# EAGLE schematic massmfg_programming_jig (EAGLE 5.11)
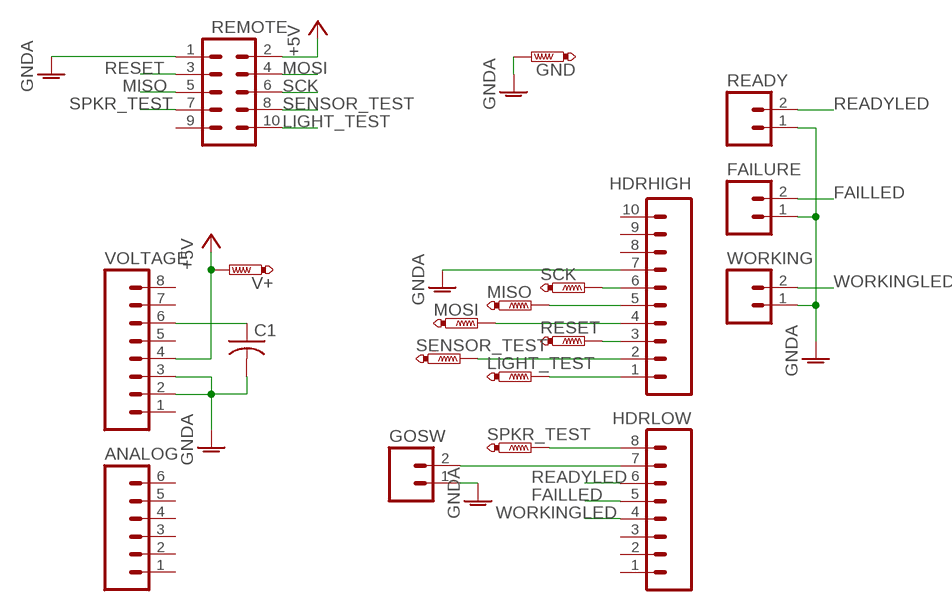
[diagram p0: schematic, sheet 1]

## Parts
ANALOG  M06LONGPADS  [1X06_LONGPADS]
C1  C-US025-024X044  [C025-024X044]
FAILURE  M02-JST-2-PTH-NO_SILK  [JST-2-PTH-NS]
GND  PTR1PAD1-20Y  [P1-20Y]
GOSW  M02-JST-2-PTH-NO_SILK  [JST-2-PTH-NS]
HDRHIGH  M10"  [1X10]
HDRLOW  M08LONGPADS  [1X08_LONGPADS]
LIGHT_TEST  PTR1PAD1-20Y  [P1-20Y]
MISO  PTR1PAD1-20Y  [P1-20Y]
MOSI  PTR1PAD1-20Y  [P1-20Y]
READY  M02-JST-2-PTH-NO_SILK  [JST-2-PTH-NS]
REMOTE  M05X2SHD  [2X5-SHROUDED]
RESET  PTR1PAD1-20Y  [P1-20Y]
SCK  PTR1PAD1-20Y  [P1-20Y]
SENSOR_TEST  PTR1PAD1-20Y  [P1-20Y]
SPKR_TEST  PTR1PAD1-20Y  [P1-20Y]
V+  PTR1PAD1-20Y  [P1-20Y]
VOLTAGE  M08LONGPADS  [1X08_LONGPADS]
WORKING  M02-JST-2-PTH-NO_SILK  [JST-2-PTH-NS]

## Nets
+5V: REMOTE.2 V+.TP VOLTAGE.4
FAILLED: FAILURE.2 HDRLOW.5
GNDA: C1.2 FAILURE.1 GND.TP GOSW.1 HDRHIGH.7 READY.1 REMOTE.1 VOLTAGE.2 VOLTAGE.3 WORKING.1
LIGHT_TEST: HDRHIGH.1 LIGHT_TEST.TP REMOTE.10
MISO: HDRHIGH.5 MISO.TP REMOTE.5
MOSI: HDRHIGH.4 MOSI.TP REMOTE.4
N$3: C1.1 VOLTAGE.6
N$5: GOSW.2 HDRLOW.7
READYLED: HDRLOW.6 READY.2
RESET: HDRHIGH.3 REMOTE.3 RESET.TP
SCK: HDRHIGH.6 REMOTE.6 SCK.TP
SENSOR_TEST: HDRHIGH.2 REMOTE.8 SENSOR_TEST.TP
SPKR_TEST: HDRLOW.8 REMOTE.7 SPKR_TEST.TP
WORKINGLED: HDRLOW.4 WORKING.2
Unconnected: ANALOG.1 ANALOG.2 ANALOG.3 ANALOG.4 ANALOG.5 ANALOG.6 HDRHIGH.8 HDRHIGH.9 HDRHIGH.10 HDRLOW.1 HDRLOW.2 HDRLOW.3 REMOTE.9 VOLTAGE.1 VOLTAGE.5 VOLTAGE.7 VOLTAGE.8

## Library data of the parts
ANALOG = SparkFun:M06: Header 6 Standard 6-pin 0.1" header. Use with straight break away headers (SKU : PRT-00116), right angle break away headers (PRT-00553), swiss pins (PRT-00743), machine pins (PRT-00117), and female headers (PRT-00115). Molex polarized connector foot print use with SKU : PRT-08094 with associated crimp pins and housings. NOTES ON THE VARIANTS LOCK and LOCK_LONGPADS... This footprint was designed to help hold the alignment of a through-hole component (i.e. 6-pin header) while soldering it into place. You may notice that each hole has been shifted either up or down by 0.005 of an inch from it's more standard position (which is a perfectly straight line). This slight alteration caused the pins (the squares in the middle) to touch the edges of the holes. Because they are alternating, it causes a "brace" to hold the component in place. 0.005 has proven to be the perfect amount of "off-center" position when using our standard breakaway headers. Although looks a little odd when you look at the bare footprint, once you have a header in there, the alteration is very hard to notice. Also, if you push a header all the way into place, it is covered up entirely on the bottom side. This idea of altering the position of holes to aid alignment will be further integrated into the Sparkfun Library for other footprints. It can help hold any component with 3 or more connection pins.
C1 = rcl:C-US: CAPACITOR, American symbol
FAILURE GOSW READY WORKING = SparkFun:M02: Header 2 Standard 2-pin 0.1" header. Use with straight break away headers (SKU : PRT-00116), right angle break away headers (PRT-00553), swiss pins (PRT-00743), machine pins (PRT-00117), and female headers (PRT-00115). Molex polarized connector foot print use with SKU : PRT-08233 with associated crimp pins and housings.
GND LIGHT_TEST MISO MOSI RESET SCK SENSOR_TEST SPKR_TEST V+ = testpad:PTR1: TEST PIN
HDRHIGH = SparkFun:M10: Header 10 Standard 10-pin 0.1" header. Use with straight break away headers (SKU : PRT-00116), right angle break away headers (PRT-00553), swiss pins (PRT-00743), machine pins (PRT-00117), and female headers (PRT-00115).
HDRLOW VOLTAGE = SparkFun:M08: Header 8 Standard 8-pin 0.1" header. Use with straight break away headers (SKU : PRT-00116), right angle break away headers (PRT-00553), swiss pins (PRT-00743), machine pins (PRT-00117), and female headers (PRT-00115).
REMOTE = SparkFun:M05X2: Header 5x2 Standard 10-pin dual row 0.1" header. Commonly used with AVR-ISP. Use with Spark Fun Electronics SKU: PRT-00778